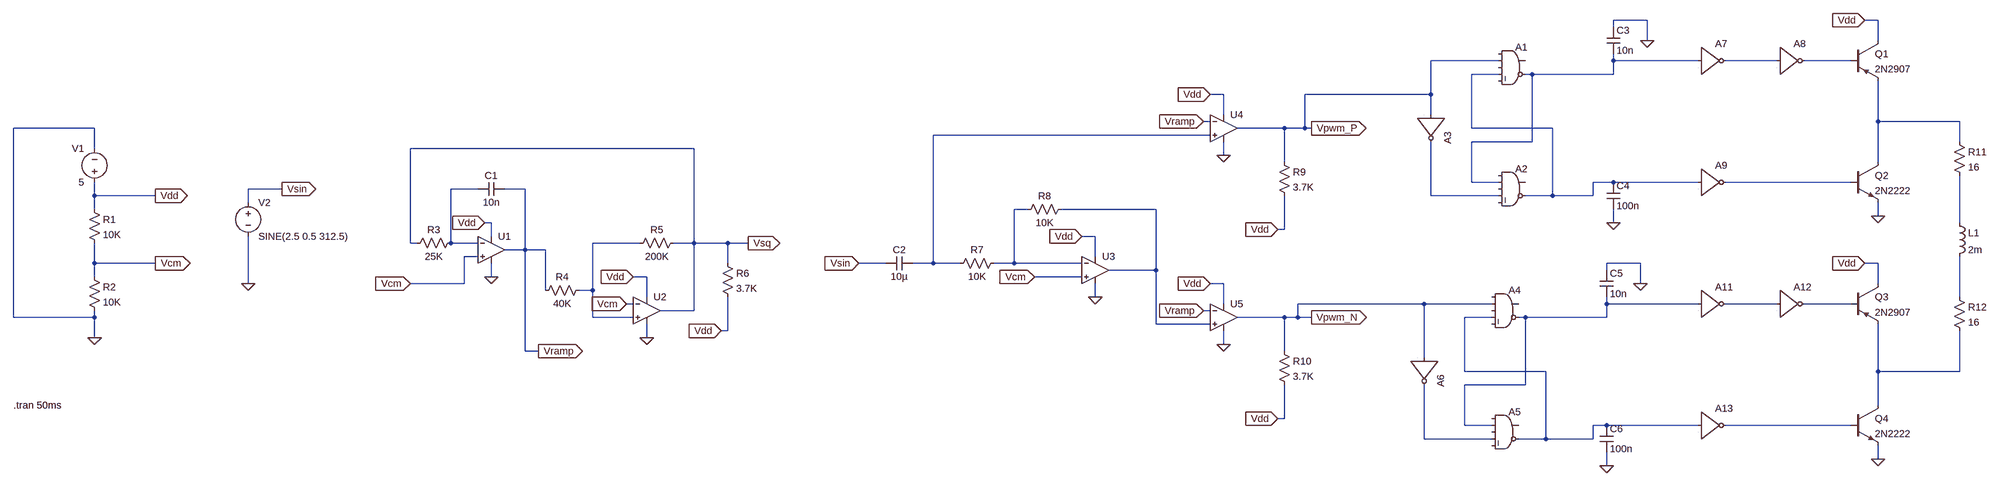
[diagram p0: schematic H-BRIDGE DRIVER AND INTEGRATION.asc]
H-BRIDGE DRIVER AND INTEGRATION.asc, the LTspice schematic file:
Version 4.1
SHEET 1 3780 680
WIRE 2672 -496 2592 -496
WIRE 3424 -496 3392 -496
WIRE 2592 -480 2592 -496
WIRE 2672 -448 2672 -496
WIRE 3424 -448 3424 -496
WIRE 2320 -400 2160 -400
WIRE 2592 -400 2592 -416
WIRE 2896 -400 2592 -400
WIRE 3184 -400 2960 -400
WIRE 3360 -400 3248 -400
WIRE 2320 -368 2256 -368
WIRE 2400 -368 2384 -368
WIRE 2592 -368 2592 -400
WIRE 2592 -368 2400 -368
WIRE 1504 -320 1472 -320
WIRE 2160 -320 2160 -400
WIRE 2160 -320 1696 -320
WIRE 1504 -272 1504 -320
WIRE 2160 -272 2160 -320
WIRE 1472 -256 1456 -256
WIRE 3424 -256 3424 -352
WIRE 3712 -256 3424 -256
WIRE -1280 -240 -1472 -240
WIRE 1648 -240 1536 -240
WIRE 1696 -240 1696 -320
WIRE 1696 -240 1648 -240
WIRE 1712 -240 1696 -240
WIRE 2256 -240 2256 -368
WIRE 2448 -240 2256 -240
WIRE 1472 -224 816 -224
WIRE 2400 -208 2400 -368
WIRE 2400 -208 2256 -208
WIRE 3712 -208 3712 -256
WIRE -1280 -192 -1280 -240
WIRE 208 -192 -464 -192
WIRE 1504 -176 1504 -208
WIRE 1648 -160 1648 -240
WIRE 3424 -160 3424 -256
WIRE 2256 -112 2256 -208
WIRE 2320 -112 2256 -112
WIRE 2592 -112 2544 -112
WIRE 2896 -112 2592 -112
WIRE 3360 -112 2960 -112
WIRE -768 -96 -848 -96
WIRE -304 -96 -368 -96
WIRE -192 -96 -240 -96
WIRE -1280 -80 -1280 -112
WIRE -1136 -80 -1280 -80
WIRE 2160 -80 2160 -208
WIRE 2320 -80 2160 -80
WIRE 2448 -80 2448 -240
WIRE 2448 -80 2384 -80
WIRE 2544 -80 2544 -112
WIRE 2544 -80 2448 -80
WIRE -848 -64 -848 -96
WIRE -1280 -48 -1280 -80
WIRE 1040 -48 1008 -48
WIRE 1344 -48 1120 -48
WIRE 3424 -32 3424 -64
WIRE -272 -16 -288 -16
WIRE 2592 -16 2592 -48
WIRE 3712 -16 3712 -128
WIRE 1648 0 1648 -80
WIRE 1648 0 1632 0
WIRE -272 16 -272 -16
WIRE 1200 16 1168 16
WIRE -464 32 -464 -192
WIRE -448 32 -464 32
WIRE -368 32 -368 -96
WIRE -304 32 -368 32
WIRE 80 32 -32 32
WIRE 208 32 208 -192
WIRE 208 32 160 32
WIRE 288 32 208 32
WIRE 336 32 288 32
WIRE -192 48 -192 -96
WIRE -192 48 -240 48
WIRE -144 48 -192 48
WIRE -304 64 -336 64
WIRE 1200 64 1200 16
WIRE -1280 80 -1280 32
WIRE -1136 80 -1280 80
WIRE 288 80 288 32
WIRE 704 80 640 80
WIRE 816 80 816 -224
WIRE 816 80 768 80
WIRE 880 80 816 80
WIRE 1008 80 1008 -48
WIRE 1008 80 960 80
WIRE 1168 80 1008 80
WIRE 2656 80 2576 80
WIRE 3424 80 3392 80
WIRE 1344 96 1344 -48
WIRE 1344 96 1232 96
WIRE 2576 96 2576 80
WIRE -1280 112 -1280 80
WIRE -272 112 -272 80
WIRE 96 112 64 112
WIRE 1168 112 1056 112
WIRE -848 128 -848 16
WIRE -336 128 -336 64
WIRE -336 128 -464 128
WIRE 1504 128 1472 128
WIRE 2656 128 2656 80
WIRE 3424 128 3424 80
WIRE -144 144 -144 48
WIRE -32 144 -32 32
WIRE -32 144 -64 144
WIRE 96 160 96 112
WIRE 1200 160 1200 128
WIRE 3712 160 3712 64
WIRE 64 176 48 176
WIRE 1504 176 1504 128
WIRE 2144 176 1680 176
WIRE 2304 176 2144 176
WIRE 2576 176 2576 160
WIRE 2896 176 2576 176
WIRE 3184 176 2960 176
WIRE 3360 176 3248 176
WIRE 208 192 208 32
WIRE 208 192 128 192
WIRE 1472 192 1456 192
WIRE -1472 208 -1472 -240
WIRE -1280 208 -1280 192
WIRE -1280 208 -1472 208
WIRE -32 208 -32 144
WIRE 64 208 -32 208
WIRE 1648 208 1536 208
WIRE 1680 208 1680 176
WIRE 1680 208 1648 208
WIRE 1712 208 1680 208
WIRE 2304 208 2240 208
WIRE 2384 208 2368 208
WIRE 2576 208 2576 176
WIRE 2576 208 2384 208
WIRE 1344 224 1344 96
WIRE 1472 224 1344 224
WIRE 288 240 288 160
WIRE 288 240 272 240
WIRE -1280 256 -1280 208
WIRE 96 256 96 224
WIRE 1504 272 1504 240
WIRE -192 288 -192 48
WIRE -160 288 -192 288
WIRE 1648 288 1648 208
WIRE 2144 304 2144 176
WIRE 2240 336 2240 208
WIRE 2432 336 2240 336
WIRE 3424 336 3424 224
WIRE 3712 336 3712 240
WIRE 3712 336 3424 336
WIRE 2384 368 2384 208
WIRE 2384 368 2240 368
WIRE 3424 416 3424 336
WIRE 1648 448 1648 368
WIRE 1648 448 1632 448
WIRE 2240 464 2240 368
WIRE 2304 464 2240 464
WIRE 2576 464 2544 464
WIRE 2896 464 2576 464
WIRE 3360 464 2960 464
WIRE 2144 496 2144 368
WIRE 2304 496 2144 496
WIRE 2432 496 2432 336
WIRE 2432 496 2368 496
WIRE 2544 496 2544 464
WIRE 2544 496 2432 496
WIRE 3424 544 3424 512
WIRE 2576 560 2576 528
FLAG -1280 256 0
FLAG -1136 80 Vcm
IOPIN -1136 80 Out
FLAG -1136 -80 Vdd
IOPIN -1136 -80 Out
FLAG -464 128 Vcm
IOPIN -464 128 In
FLAG -288 -16 Vdd
IOPIN -288 -16 In
FLAG 64 112 Vdd
IOPIN 64 112 In
FLAG -272 112 0
FLAG 96 256 0
FLAG 48 176 Vcm
IOPIN 48 176 In
FLAG -160 288 Vramp
IOPIN -160 288 Out
FLAG 336 32 Vsq
IOPIN 336 32 Out
FLAG 272 240 Vdd
IOPIN 272 240 In
FLAG 1168 16 Vdd
IOPIN 1168 16 In
FLAG 1200 160 0
FLAG 1056 112 Vcm
IOPIN 1056 112 In
FLAG 640 80 Vsin
IOPIN 640 80 In
FLAG -848 128 0
FLAG -768 -96 Vsin
IOPIN -768 -96 Out
FLAG 1472 -320 Vdd
IOPIN 1472 -320 In
FLAG 1504 -176 0
FLAG 1456 -256 Vramp
IOPIN 1456 -256 In
FLAG 1472 128 Vdd
IOPIN 1472 128 In
FLAG 1504 272 0
FLAG 1456 192 Vramp
IOPIN 1456 192 In
FLAG 1712 -240 Vpwm_P
IOPIN 1712 -240 Out
FLAG 1712 208 Vpwm_N
IOPIN 1712 208 Out
FLAG 1632 0 Vdd
IOPIN 1632 0 In
FLAG 1632 448 Vdd
IOPIN 1632 448 In
FLAG 2672 -448 0
FLAG 2592 -16 0
FLAG 2656 128 0
FLAG 2576 560 0
FLAG 3424 -32 0
FLAG 3424 544 0
FLAG 3392 -496 Vdd
IOPIN 3392 -496 In
FLAG 3392 80 Vdd
IOPIN 3392 80 In
SYMBOL res -1296 -64 R0
SYMATTR InstName R1
SYMATTR Value 10K
SYMBOL res -1296 96 R0
SYMATTR InstName R2
SYMATTR Value 10K
SYMBOL OpAmps\\UniversalOpAmp1 -272 48 R0
SYMATTR InstName U1
SYMBOL res -352 16 R90
WINDOW 0 0 56 VBottom 2
WINDOW 3 32 56 VTop 2
SYMATTR InstName R3
SYMATTR Value 25K
SYMBOL voltage -1280 -96 R180
WINDOW 0 24 96 Left 2
WINDOW 3 24 16 Left 2
WINDOW 123 0 0 Left 0
WINDOW 39 0 0 Left 0
SYMATTR InstName V1
SYMATTR Value 5
SYMBOL OpAmps\\UniversalOpAmp2 96 192 R0
SYMATTR InstName U2
SYMBOL res -48 128 R90
WINDOW 0 0 56 VBottom 2
WINDOW 3 32 56 VTop 2
SYMATTR InstName R4
SYMATTR Value 40K
SYMBOL res 176 16 R90
WINDOW 0 0 56 VBottom 2
WINDOW 3 32 56 VTop 2
SYMATTR InstName R5
SYMATTR Value 200K
SYMBOL cap -240 -112 R90
WINDOW 0 0 32 VBottom 2
WINDOW 3 32 32 VTop 2
SYMATTR InstName C1
SYMATTR Value 10n
SYMBOL res 272 64 R0
SYMATTR InstName R6
SYMATTR Value 3.7K
SYMBOL OpAmps\\UniversalOpAmp2 1200 96 R0
SYMATTR InstName U3
SYMBOL res 976 64 R90
WINDOW 0 0 56 VBottom 2
WINDOW 3 32 56 VTop 2
SYMATTR InstName R7
SYMATTR Value 10K
SYMBOL res 1136 -64 R90
WINDOW 0 0 56 VBottom 2
WINDOW 3 32 56 VTop 2
SYMATTR InstName R8
SYMATTR Value 10K
SYMBOL cap 704 64 M90
WINDOW 0 0 32 VBottom 2
WINDOW 3 32 32 VTop 2
SYMATTR InstName C2
SYMATTR Value 10µ
SYMATTR SpiceLine Irms=0
SYMBOL voltage -848 -80 R0
WINDOW 123 0 0 Left 0
WINDOW 39 0 0 Left 0
SYMATTR InstName V2
SYMATTR Value SINE(2.5 0.5 312.5)
SYMBOL OpAmps\\UniversalOpAmp2 1504 -240 R0
SYMATTR InstName U4
SYMBOL OpAmps\\UniversalOpAmp2 1504 208 R0
SYMATTR InstName U5
SYMBOL res 1632 -176 R0
SYMATTR InstName R9
SYMATTR Value 3.7K
SYMBOL res 1632 272 R0
SYMATTR InstName R10
SYMATTR Value 3.7K
SYMBOL Digital\\and 2352 -448 R0
SYMATTR InstName A1
SYMBOL Digital\\and 2352 -160 R0
SYMATTR InstName A2
SYMBOL Digital\\inv 2224 -272 R90
SYMATTR InstName A3
SYMBOL cap 2576 -480 R0
SYMATTR InstName C3
SYMATTR Value 10n
SYMBOL cap 2576 -112 R0
SYMATTR InstName C4
SYMATTR Value 100n
SYMBOL Digital\\and 2336 128 R0
SYMATTR InstName A4
SYMBOL Digital\\and 2336 416 R0
SYMATTR InstName A5
SYMBOL Digital\\inv 2208 304 R90
SYMATTR InstName A6
SYMBOL cap 2560 96 R0
SYMATTR InstName C5
SYMATTR Value 10n
SYMBOL cap 2560 464 R0
SYMATTR InstName C6
SYMATTR Value 100n
SYMBOL Digital\\inv 2896 -464 R0
SYMATTR InstName A7
SYMBOL Digital\\inv 3184 -464 R0
SYMATTR InstName A8
SYMBOL Digital\\inv 2896 -176 R0
SYMATTR InstName A9
SYMBOL npn 3360 -160 R0
SYMATTR InstName Q2
SYMATTR Value 2N2222
SYMBOL res 3696 -224 R0
SYMATTR InstName R11
SYMATTR Value 16
SYMBOL res 3696 144 R0
SYMATTR InstName R12
SYMATTR Value 16
SYMBOL ind 3696 -32 R0
SYMATTR InstName L1
SYMATTR Value 2m
SYMATTR SpiceLine Rser=1m
SYMBOL Digital\\inv 2896 112 R0
SYMATTR InstName A11
SYMBOL Digital\\inv 3184 112 R0
SYMATTR InstName A12
SYMBOL Digital\\inv 2896 400 R0
SYMATTR InstName A13
SYMBOL npn 3360 416 R0
SYMATTR InstName Q4
SYMATTR Value 2N2222
SYMBOL pnp 3360 -448 R0
SYMATTR InstName Q1
SYMATTR Value 2N2907
SYMBOL pnp 3360 128 R0
SYMATTR InstName Q3
SYMATTR Value 2N2907
TEXT -1472 416 Left 2 !.tran 50ms

The netlist it stands for:
* H-BRIDGE DRIVER AND INTEGRATION.asc
R1 Vdd Vcm 10K
R2 Vcm 0 10K
X§U1 Vcm N008 Vdd 0 Vramp level1 Avol=1Meg GBW=10Meg Vos=0 En=0 Enk=0 In=0 Ink=0 Rin=500Meg  ; pins In+ In- V+ V- OUT
R3 N008 Vsq 25K
V1 Vdd 0 5
X§U2 N013 Vcm Vdd 0 Vsq level2 Avol=1Meg GBW=10Meg Slew=10Meg Ilimit=25m Rail=0 Vos=0 En=0 Enk=0 In=0 Ink=0 Rin=500Meg  ; pins In+ In- V+ V- OUT
R4 N013 Vramp 40K
R5 Vsq N013 200K
C1 Vramp N008 10n
R6 Vsq Vdd 3.7K
X§U3 Vcm N010 Vdd 0 N011 level2 Avol=1Meg GBW=10Meg Slew=10Meg Ilimit=25m Rail=0 Vos=0 En=0 Enk=0 In=0 Ink=0 Rin=500Meg  ; pins In+ In- V+ V- OUT
R7 N010 N006 10K
R8 N011 N010 10K
C2 Vsin N006 10µ Irms=0
V2 Vsin 0 SINE(2.5 0.5 312.5)
X§U4 N006 Vramp Vdd 0 Vpwm_P level2 Avol=1Meg GBW=10Meg Slew=10Meg Ilimit=25m Rail=0 Vos=0 En=0 Enk=0 In=0 Ink=0 Rin=500Meg  ; pins In+ In- V+ V- OUT
X§U5 N011 Vramp Vdd 0 Vpwm_N level2 Avol=1Meg GBW=10Meg Slew=10Meg Ilimit=25m Rail=0 Vos=0 En=0 Enk=0 In=0 Ink=0 Rin=500Meg  ; pins In+ In- V+ V- OUT
R9 Vpwm_P Vdd 3.7K
R10 Vpwm_N Vdd 3.7K
A1 0 Vpwm_P 0 N004 0 N001 0 0 AND
A2 0 N001 0 N009 0 N004 0 0 AND
A3 Vpwm_P 0 0 0 0 N009 0 0 BUF
C3 0 N001 10n
C4 N004 0 100n
A4 0 Vpwm_N 0 N018 0 N015 0 0 AND
A5 0 N015 0 N021 0 N018 0 0 AND
A6 Vpwm_N 0 0 0 0 N021 0 0 BUF
C5 0 N015 10n
C6 N018 0 100n
A7 N001 0 0 0 0 N002 0 0 BUF
A8 N002 0 0 0 0 N003 0 0 BUF
A9 N004 0 0 0 0 N007 0 0 BUF
Q2 N005 N007 0 0 2N2222
R11 N005 N012 16
R12 N014 N019 16
L1 N012 N014 2m Rser=1m
A11 N015 0 0 0 0 N016 0 0 BUF
A12 N016 0 0 0 0 N017 0 0 BUF
A13 N018 0 0 0 0 N020 0 0 BUF
Q4 N019 N020 0 0 2N2222
Q1 Vdd N003 N005 0 2N2907
Q3 Vdd N017 N019 0 2N2907
.model NPN NPN
.model PNP PNP
.lib standard.bjt
.tran 50ms
.lib UniversalOpAmp1.lib
.lib UniversalOpAmp2.lib
.backanno
.end